# EAGLE design LightSensorCircuitSMT (EAGLE 9.6.2)
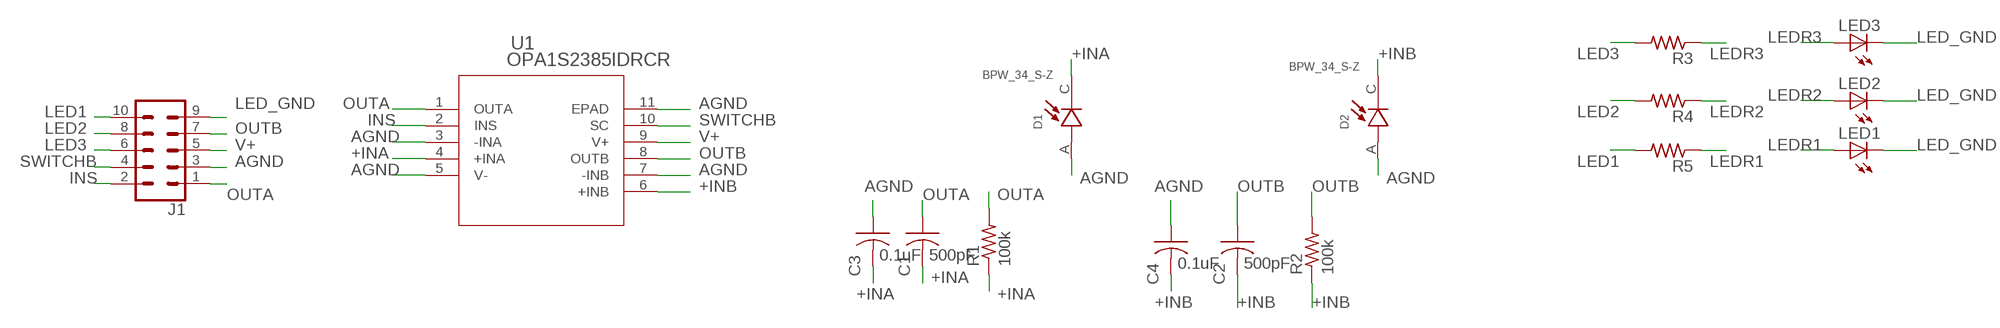
[diagram p0: schematic, sheet 1]

## Parts
C1  500pF  C-USC0603  [C0603]
C2  500pF  C-USC0603  [C0603]
C3  0.1uF  C-USC0603  [C0603]
C4  0.1uF  C-USC0603  [C0603]
D1  BPW_34_S-Z  [DIO_BPW_34_S-Z]
D2  BPW_34_S-Z  [DIO_BPW_34_S-Z]
J1  CONN_05X2NO_SILK  [2X5_NOSILK]
LED1  LEDCHIPLED_1206  [CHIPLED_1206]
LED2  LEDCHIPLED_1206  [CHIPLED_1206]
LED3  LEDCHIPLED_1206  [CHIPLED_1206]
R1  100k  R-US_R0603  [R0603]
R2  100k  R-US_R0603  [R0603]
R3  R-US_R0603  [R0603]
R4  R-US_R0603  [R0603]
R5  R-US_R0603  [R0603]
U1  OPA1S2385IDRCR  [DRC10_1P65X2P40_TEX]

## Nets
+INA: C1.2 C3.2 D1.C R1.1 U1.4(+INA)
+INB: C2.2 C4.2 D2.C R2.1 U1.6(+INB)
AGND: C3.1 C4.1 D1.A D2.A J1.3 U1.3(-INA) U1.5(V-) U1.7(-INB) U1.11(EPAD)
INS: J1.2 U1.2(INS)
LED1: J1.10 R5.2
LED2: J1.8 R4.2
LED3: J1.6 R3.2
LED_GND: J1.9 LED1.C LED2.C LED3.C
LEDR1: LED1.A R5.1
LEDR2: LED2.A R4.1
LEDR3: LED3.A R3.1
OUTA: C1.1 J1.1 R1.2 U1.1(OUTA)
OUTB: C2.1 J1.7 R2.2 U1.8(OUTB)
SWITCHB: J1.4 U1.10(SC)
V+: J1.5 U1.9(V+)

## Library data of the parts
C1-C4 = adafruit:C-US: CAPACITOR, American symbol
D1 D2 = BPW_34_S-Z:BPW_34_S-Z: Silicon PIN Photodiode Check availability <https://pricing.snapeda.com/parts/BPW%2034%20S-Z/OSRAM%20Opto/view-part?ref=eda>; AVAILABILITY: In Stock; DESCRIPTION: Photodiode 850nm 20ns 120° 2-SMD, Gull Wing; MF: OSRAM Opto; MP: BPW 34 S-Z; PACKAGE: SMD-2 OSRAM Opto Semiconductors; PRICE: None; PURCHASE-URL: https://pricing.snapeda.com/search/part/BPW 34 S-Z/?ref=eda
J1 = SparkFun-Connectors:CONN_05X2: Multi connection point. Often used as Generic Header-pin footprint for 0.1 inch spaced/style header connections For AVR SPI programming port, see special device with nice symbol: "AVR_SPI_PROG_5x2.dev" You can populate with any combo of single row headers, but if you'd like an exact match, check these: 2x5 AVR ICSP Male Header <https://www.sparkfun.com/products/778> (PRT-00778) 2x5 Pin Shrouded Header <https://www.sparkfun.com/products/8506> (PRT-08506) On any of the 0.1 inch spaced packages, you can populate with these: Break Away Headers - Straight <https://www.sparkfun.com/products/116> (PRT-00116) Break Away Male Headers - Right Angle <https://www.sparkfun.com/products/553> (PRT-00553) Female Headers <https://www.sparkfun.com/products/115> (PRT-00115) Break Away Headers - Machine Pin <https://www.sparkfun.com/products/117> (PRT-00117) Break Away Female Headers - Swiss Machine Pin <https://www.sparkfun.com/products/743> (PRT-00743) Special note: the shrouded connector mates well with our 5x2 ribbon cables: 2x5 Pin IDC Ribbon Cable <https://www.sparkfun.com/products/8535> (PRT-08535)
LED1-LED3 = adafruit:LED: LED OSRAM: - CHIPLED LG R971, LG N971, LY N971, LG Q971, LY Q971, LO R971, LY R971 LH N974, LH R974 LS Q976, LO Q976, LY Q976 LO Q996 - Hyper CHIPLED LW Q18S LB Q993, LB Q99A, LB R99A - SideLED LS A670, LO A670, LY A670, LG A670, LP A670 LB A673, LV A673, LT A673, LW A673 LH A674 LY A675 LS A676, LA A676, LO A676, LY A676, LW A676 LS A679, LY A679, LG A679 - Hyper Micro SIDELED® LS Y876, LA Y876, LO Y876, LY Y876 LT Y87S - SmartLED LW L88C, LW L88S LB L89C, LB L89S, LG L890 LS L89K, LO L89K, LY L89K LS L896, LA L896, LO L896, LY L896 - TOPLED LS T670, LO T670, LY T670, LG T670, LP T670 LSG T670, LSP T670, LSY T670, LOP T670, LYG T670 LG T671, LOG T671, LSG T671 LB T673, LV T673, LT T673, LW T673 LH T674 LS T676, LA T676, LO T676, LY T676, LB T676, LH T676, LSB T676, LW T676 LB T67C, LV T67C, LT T67C, LS T67K, LO T67K, LY T67K, LW E67C LS E67B, LA E67B, LO E67B, LY E67B, LB E67C, LV E67C, LT E67C LW T67C LS T679, LY T679, LG T679 LS T770, LO T770, LY T770, LG T770, LP T770 LB T773, LV T773, LT T773, LW T773 LH T774 LS E675, LA E675, LY E675, LS T675 LS T776, LA T776, LO T776, LY T776, LB T776 LHGB T686 LT T68C, LB T68C - Hyper Mini TOPLED® LB M676 - Mini TOPLED Santana® LG M470 LS M47K, LO M47K, LY M47K Source: http://www.osram.convergy.de/
R1-R5 = adafruit:R-US_: RESISTOR, American symbol
U1 = OPA1S2385IDRCR:OPA1S2385IDRCR; COPYRIGHT: Copyright (C) 2022 Ultra Librarian. All rights reserved.; MANUFACTURER_PART_NUMBER: OPA1S2385IDRCR; MFR_NAME: Texas Instruments

## Board
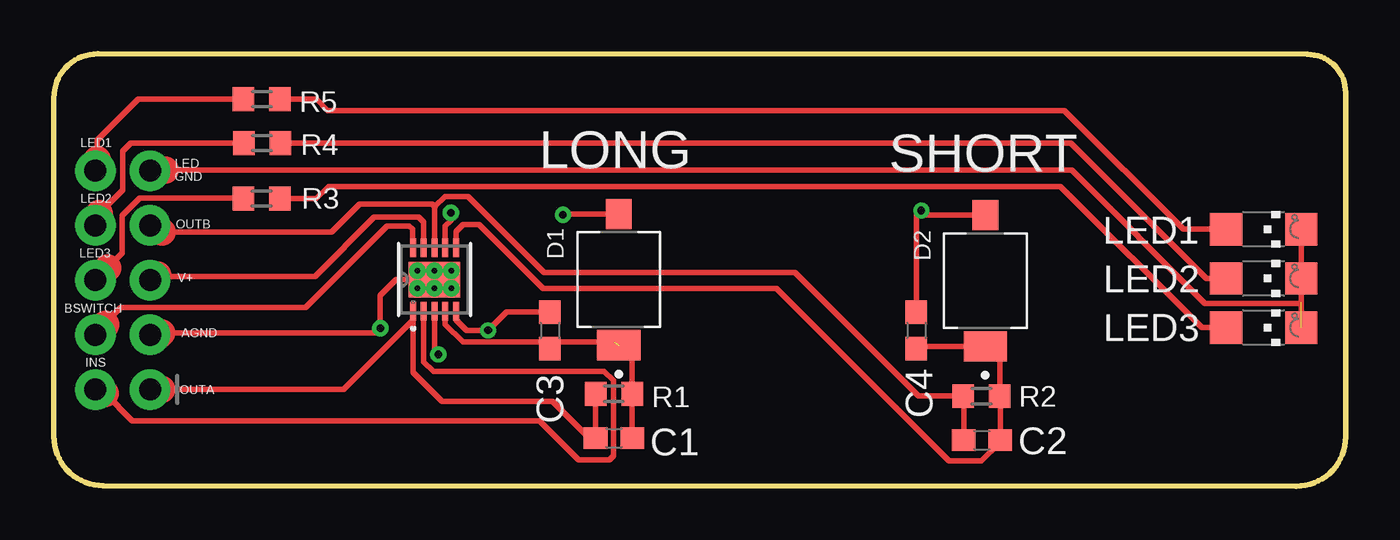
[diagram p1: board, top side]
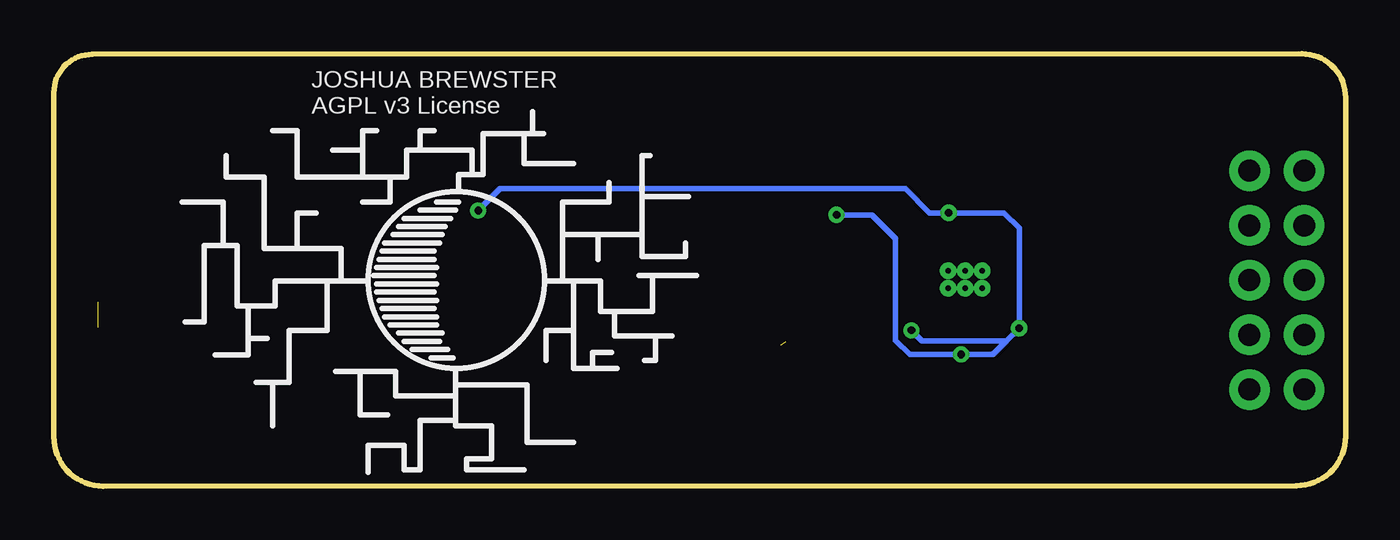
[diagram p2: board, bottom side, seen from below]

Size 59.99 x 20.09 mm. Coordinates in mm from the lower left corner, seen from the top.
Outline: 0,18.06 arc-90 2.03,20.09 58.22,20.07 arc-90 59.99,18.29 59.99,2.29 arc-90 57.71,0 2.29,0.03 arc-90 0,2.31 0,18.06
Copper layers (1*16): Top 0.035mm / dielectric 1.5mm / Bottom 0.035mm
Design rules "default *": minimum track width 6mil, minimum drill 0.35mm, track to track 6mil, track to pad 6mil, pad to pad 6mil, via to via 6mil, smd to smd 6mil, copper to edge 10mil, drill to drill 6mil, minimum pad ring 10mil, minimum via ring 8mil, stop-mask expansion 4mil, vias tented up to drill 0mil, thermal gap 10mil

### Footprints (pad centres in the part's own frame; a part is rotated, then mirrored left to right if it is on the bottom)
C0603 = smd 1.1 x 1: 1 -0.85,0; 2 0.85,0
DIO_BPW_34_S-Z = smd 1.4 x 1.2: A -3.05,0 | smd 1.4 x 2: C 3.05,0
2X5_NOSILK = drill 1.016 pad 1.88: 1 0,0; 2 0,2.54; 3 2.54,0; 4 2.54,2.54; 5 5.08,0; 6 5.08,2.54; 7 7.62,0; 8 7.62,2.54; 9 10.16,0; 10 10.16,2.54
CHIPLED_1206 = smd 1.5 x 1.5: A 0,-1.75; C 0,1.75
R0603 = smd 1 x 1.1: 1 -0.85,0; 2 0.85,0
DRC10_1P65X2P40_TEX = smd 0.85 x 0.28: 1 -1.475,1; 2 -1.475,0.5; 3 -1.475,0; 4 -1.475,-0.5; 5 -1.475,-1; 6 1.475,-1; 7 1.475,-0.5; 8 1.475,0; 9 1.475,0.5; 10 1.475,1 | smd 1.65 x 2.4: 11 0,0 | drill 0.254 pad 0.508: V -0.406,-0.787; V_1 -0.406,0; V_2 -0.406,0.787; V_3 0.406,-0.787; V_4 0.406,0; V_5 0.406,0.787

### Placement (x,y rotation side)
C1  26.01,2.24 0 top
C2  43.1,2.13 0 top
C3  23.04,7.24 270 top
C4  40.06,7.24 270 top
D1  26.24,9.6 270 top
D2  43.26,9.55 270 top
J1  4.47,4.5 90 top
LED1  56.18,11.94 270 top
LED2  56.18,9.65 270 top
LED3  56.18,7.37 270 top
R1  26.01,4.29 180 top
R2  43.08,4.19 180 top
R3  9.65,13.37 180 top
R4  9.67,15.94 180 top
R5  9.66,17.98 180 top
U1  17.68,9.6 90 top

### Tracks (layer width: path | path; a pad name or v marks a point on that pad's centre or on a via)
+INA  (1 unrouted)
  Top 0.254: U1.4 18.18,7.53 19,6.71 23.04,6.71 | 26.01,6.71 23.04,6.71 | C1.2 R1.1 26.86,5.93 D1.C | C3.2 23.04,6.71
+INB
  Top 0.254: U1.6 18.68,11.84 19.01,12.17 19.76,12.17 22.73,9.2 33.55,9.2 41.58,1.17 43.08,1.17 43.95,2.04 C2.2 43.95,4.17 R2.1 43.93,5.83 D2.C 40.17,6.5 C4.2
AGND  (via drill 0.35)
  Top 0.254: U1.5 18.68,7.72 19.16,7.24 v20.17,7.24 21.02,8.09 C3.1 | U1.7 18.18,12.08 18.44,12.34 v18.44,12.7 | U1.3 17.68,6.3 v17.86,6.12 | U1.11 15.9,9.6 15.16,8.87 v15.16,7.34 15.14,7.34 14.93,7.13 5.01,7.13 | D1.A 23.69,12.65 v23.65,12.61 | D2.A 40.5,12.6 v40.29,12.81 40.06,12.57 C4.1
  Top 1.27: J1.3 4.92,7.04 5.01,7.13
  Bottom 0.254: v40.29,12.81 39.28,13.82 20.45,13.82 19.33,12.7 v18.44,12.7 15.87,12.7 15.16,11.99 v15.16,7.34 15.75,6.76 | v23.65,12.61 22,12.61 20.9,11.52 20.9,6.78 20.24,6.12 v17.86,6.12 16.38,6.12 15.75,6.76 | v20.17,7.24 19.68,6.76 15.75,6.76
INS
  Top 0.254: U1.2 17.18,5.78 17.63,5.33 25.56,5.33 25.99,4.91 25.99,1.42 25.8,1.23 24.37,1.23 22.56,3.04 3.64,3.04 2.37,4.3
  Top 1.27: J1.2 2.18,4.5 2.37,4.3
LED1
  Top 0.254: 2.01,15.16 2.01,16.08 3.91,17.98 R5.2
  Top 1.27: J1.10 2.01,14.73 2.01,15.16
LED2
  Top 0.254: R4.2 3.57,15.94 3.2,15.57 3.2,13.77 2.11,12.67
  Top 1.27: J1.8 1.93,12.19 2.11,12.37 2.11,12.67
LED3
  Top 0.254: 2.5,10.15 2.5,10.17 3.17,10.85 3.17,12.57 3.99,13.39 8.78,13.39 R3.2
  Top 1.27: 2.5,10.15 J1.6
LED_GND  (1 unrouted)
  Top 0.254: LED3.C 57.93,8.5 53.45,8.5 47.27,14.68 4.49,14.68 J1.9 | 57.93,8.57 LED2.C LED1.C
  Top 1.27: 5.17,14.69 4.5,14.69 J1.9
LEDR1
  Top 0.254: LED1.A 52.46,11.94 46.94,17.45 12.73,17.45 12.2,17.98 R5.1
LEDR2
  Top 0.254: R4.1 47.23,15.94 53.52,9.65 LED2.A
LEDR3
  Top 0.254: LED3.A 53.31,7.37 46.75,13.93 12.76,13.93 12.19,13.37 R3.1
OUTA
  Top 0.254: 16.68,7.72 16.68,5.28 18.02,3.94 23.16,3.94 24.87,2.23 C1.1 R1.2 | U1.1 16.68,7.72 | 16.68,7.72 13.45,4.5 5,4.5
  Top 1.27: J1.1 5,4.5
OUTB
  Top 0.254: U1.8 17.68,12.95 17.7,12.98 17.69,12.98 17.69,12.99 | 17.69,12.99 18.16,13.46 19.23,13.46 22.76,9.93 34.42,9.93 40.14,4.2 42.22,4.2 R2.2 42.25,4.17 C2.1 | 17.69,12.99 17.57,13.11 14.2,13.11 12.9,11.81 5.02,11.81
  Top 1.27: J1.7 4.72,12.12 5.02,11.81
SWITCHB
  Top 0.254: U1.10 16.66,11.09 16.66,11.94 16.51,12.09 15.47,12.09 11.68,8.31 3.1,8.31 1.93,7.14 J1.4 | 2.37,7.43 2.4,7.46 2.4,7.5
  Top 1.27: 2.37,7.43 1.98,7.04 J1.4 2.4,7.5 2.38,7.52
V+
  Top 0.254: U1.9 17.17,12.27 16.94,12.5 14.88,12.5 12.14,9.75 4.87,9.75 4.82,9.8
  Top 1.27: 4.82,9.8 4.6,9.58 J1.5

### Text on the board
tPlace: LONG | SHORT
tNames: LED1 | LED2 | LED / GND | OUTB | LED3 | V+ | BSWITCH | AGND | INS | OUTA
bNames: JOSHUA BREWSTER / AGPL v3 License